# EAGLE design apic_shield (EAGLE 8.3.1)
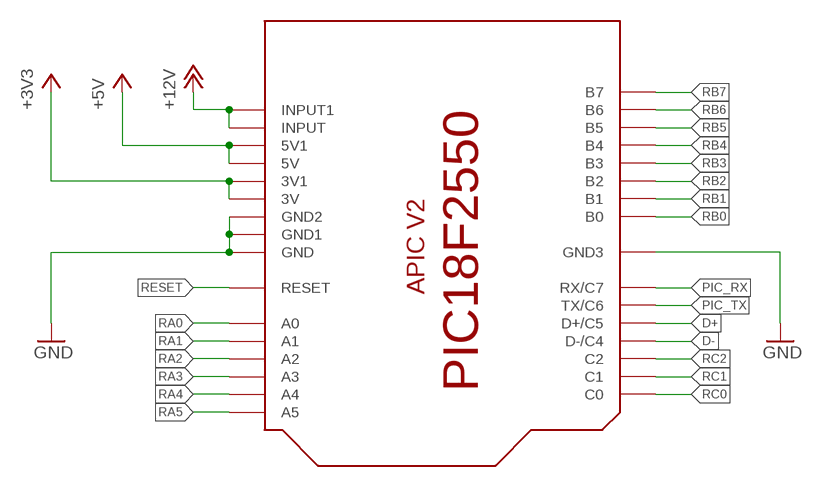
[diagram p0: schematic, sheet 1]

## Parts
U$1  APIC-18F2550  [APIC-18F2550]

## Nets
+3V3: U$1.3V U$1.3V1
+5V: U$1.5V U$1.5V1
+12V: U$1.INPUT U$1.INPUT1
D+: U$1.C5(D+/C5)
D-: U$1.C4(D-/C4)
GND: U$1.GND U$1.GND1 U$1.GND2 U$1.GND3
PIC_RX: U$1.C7(RX/C7)
PIC_TX: U$1.C6(TX/C6)
RA0: U$1.A0
RA1: U$1.A1
RA2: U$1.A2
RA3: U$1.A3
RA4: U$1.A4
RA5: U$1.A5
RB0: U$1.B0
RB1: U$1.B1
RB2: U$1.B2
RB3: U$1.B3
RB4: U$1.B4
RB5: U$1.B5
RB6: U$1.B6
RB7: U$1.B7
RC0: U$1.C0
RC1: U$1.C1
RC2: U$1.C2
RESET: U$1.RESET

## Library data of the parts
U$1 = YAEL:APIC-18F2550

## Board
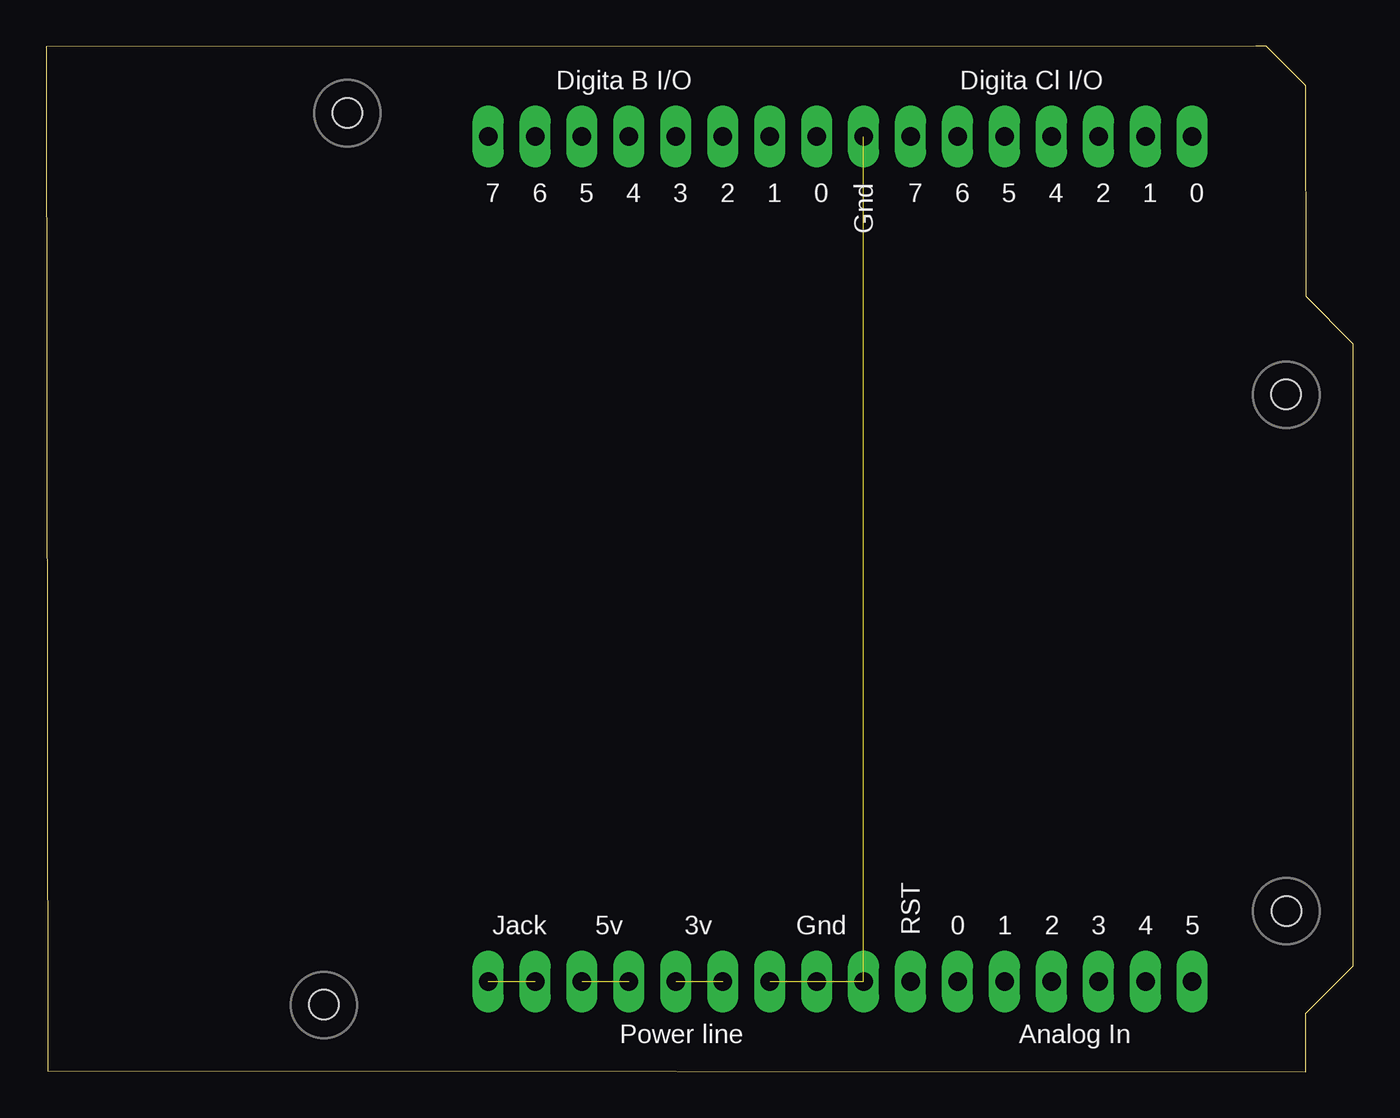
[diagram p1: board, top side]
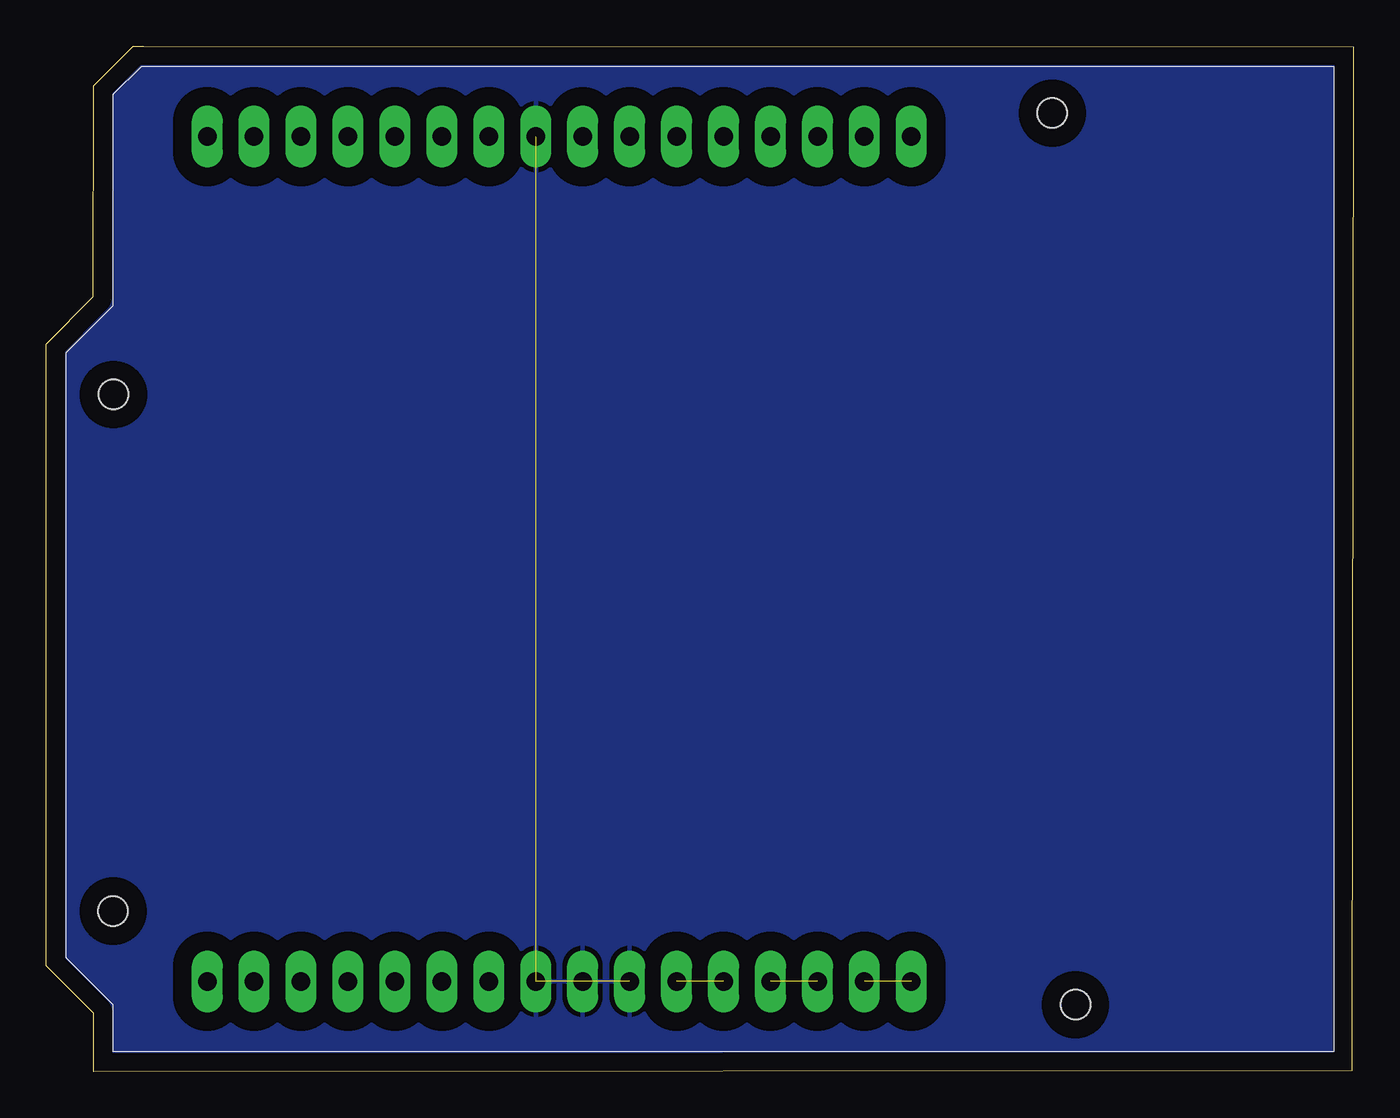
[diagram p2: board, bottom side, seen from below]

Size 70.72 x 55.49 mm. Coordinates in mm from the lower left corner, seen from the top.
Outline: 0.09,0.05 68.15,0 68.14,3.15 70.71,5.72 70.72,39.37 68.17,41.93 68.16,53.36 66.01,55.49 65.45,55.49 0,55.47 0.09,0.05
Copper layers (1*16): Top 0.035mm / dielectric 1.5mm / Bottom 0.035mm
Design rules "default": minimum track width 6mil, minimum drill 0.35mm, track to track 6mil, track to pad 6mil, pad to pad 6mil, via to via 6mil, smd to smd 6mil, copper to edge 40mil, drill to drill 6mil, minimum pad ring 10mil, minimum via ring 8mil, stop-mask expansion 4mil, vias tented up to drill 0mil, thermal gap 10mil
Holes 1.6 mm at 67.08,36.65 67.1,8.7 15.03,3.62 16.28,51.87

### Footprints (pad centres in the part's own frame; a part is rotated, then mirrored left to right if it is on the bottom)
APIC-18F2550 = drill 1 pad 1.676 long: 3V 35.56,3.81; 3V1 33.02,3.81; 5V 30.48,3.81; 5V1 27.94,3.81; A0 48.26,3.81; A1 50.8,3.81; A2 53.34,3.81; A3 55.88,3.81; A4 58.42,3.81; A5 60.96,3.81; B0 40.64,49.53; B1 38.1,49.53; B2 35.56,49.53; B3 33.02,49.53; B4 30.48,49.53; B5 27.94,49.53; B6 25.4,49.53; B7 22.86,49.53; C0 60.96,49.53; C1 58.42,49.53; C2 55.88,49.53; C4 53.34,49.53; C5 50.8,49.53; C6 48.26,49.53; C7 45.72,49.53; GND 43.18,3.81; GND1 40.64,3.81; GND2 38.1,3.81; GND3 43.18,49.53; INPUT 25.4,3.81; INPUT1 22.86,3.81; RESET 45.72,3.81

### Placement (x,y rotation side)
U$1  1.05,1.07 0 top

### Tracks (layer width: path | path; a pad name or v marks a point on that pad's centre or on a via)
+3V3  (1 unrouted)
+5V  (1 unrouted)
+12V  (1 unrouted)
GND  (3 unrouted)
  pour Bottom (isolate 1.016): -1.84,-1.5 -1.76,56.83 74.88,56.67 74.8,-1.66